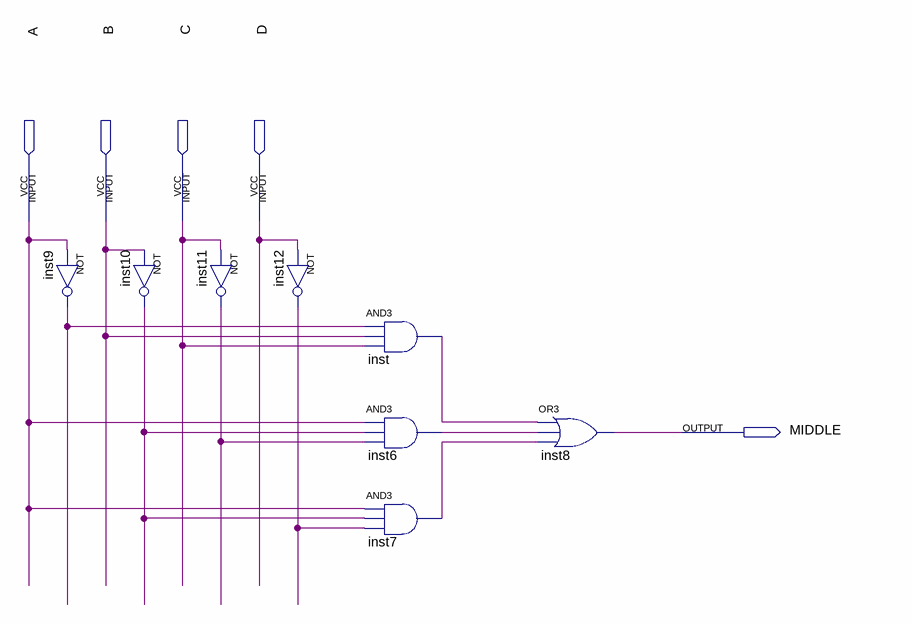
[diagram p0: schematic sheet]
// Quartus schematic middle.bdf as structural Verilog: 8 symbols, 5 pins
module middle (
  input  A,
  input  B,
  input  C,
  input  D,
  output MIDDLE
);

  wire inst6_out, inst7_out, inst9_out, inst10_out, inst11_out, inst12_out, inst_out;

  not inst9 (inst9_out, A);
  not inst10 (inst10_out, B);
  not inst11 (inst11_out, C);
  not inst12 (inst12_out, D);
  and inst (inst_out, inst9_out, B, C);
  and inst6 (inst6_out, A, inst10_out, inst11_out);
  and inst7 (inst7_out, A, inst10_out, inst12_out);
  or inst8 (MIDDLE, inst_out, inst6_out, inst7_out);
endmodule
